# EAGLE design EXCISS PSU (EAGLE 7.7.0)

## Sheet 1 of 2
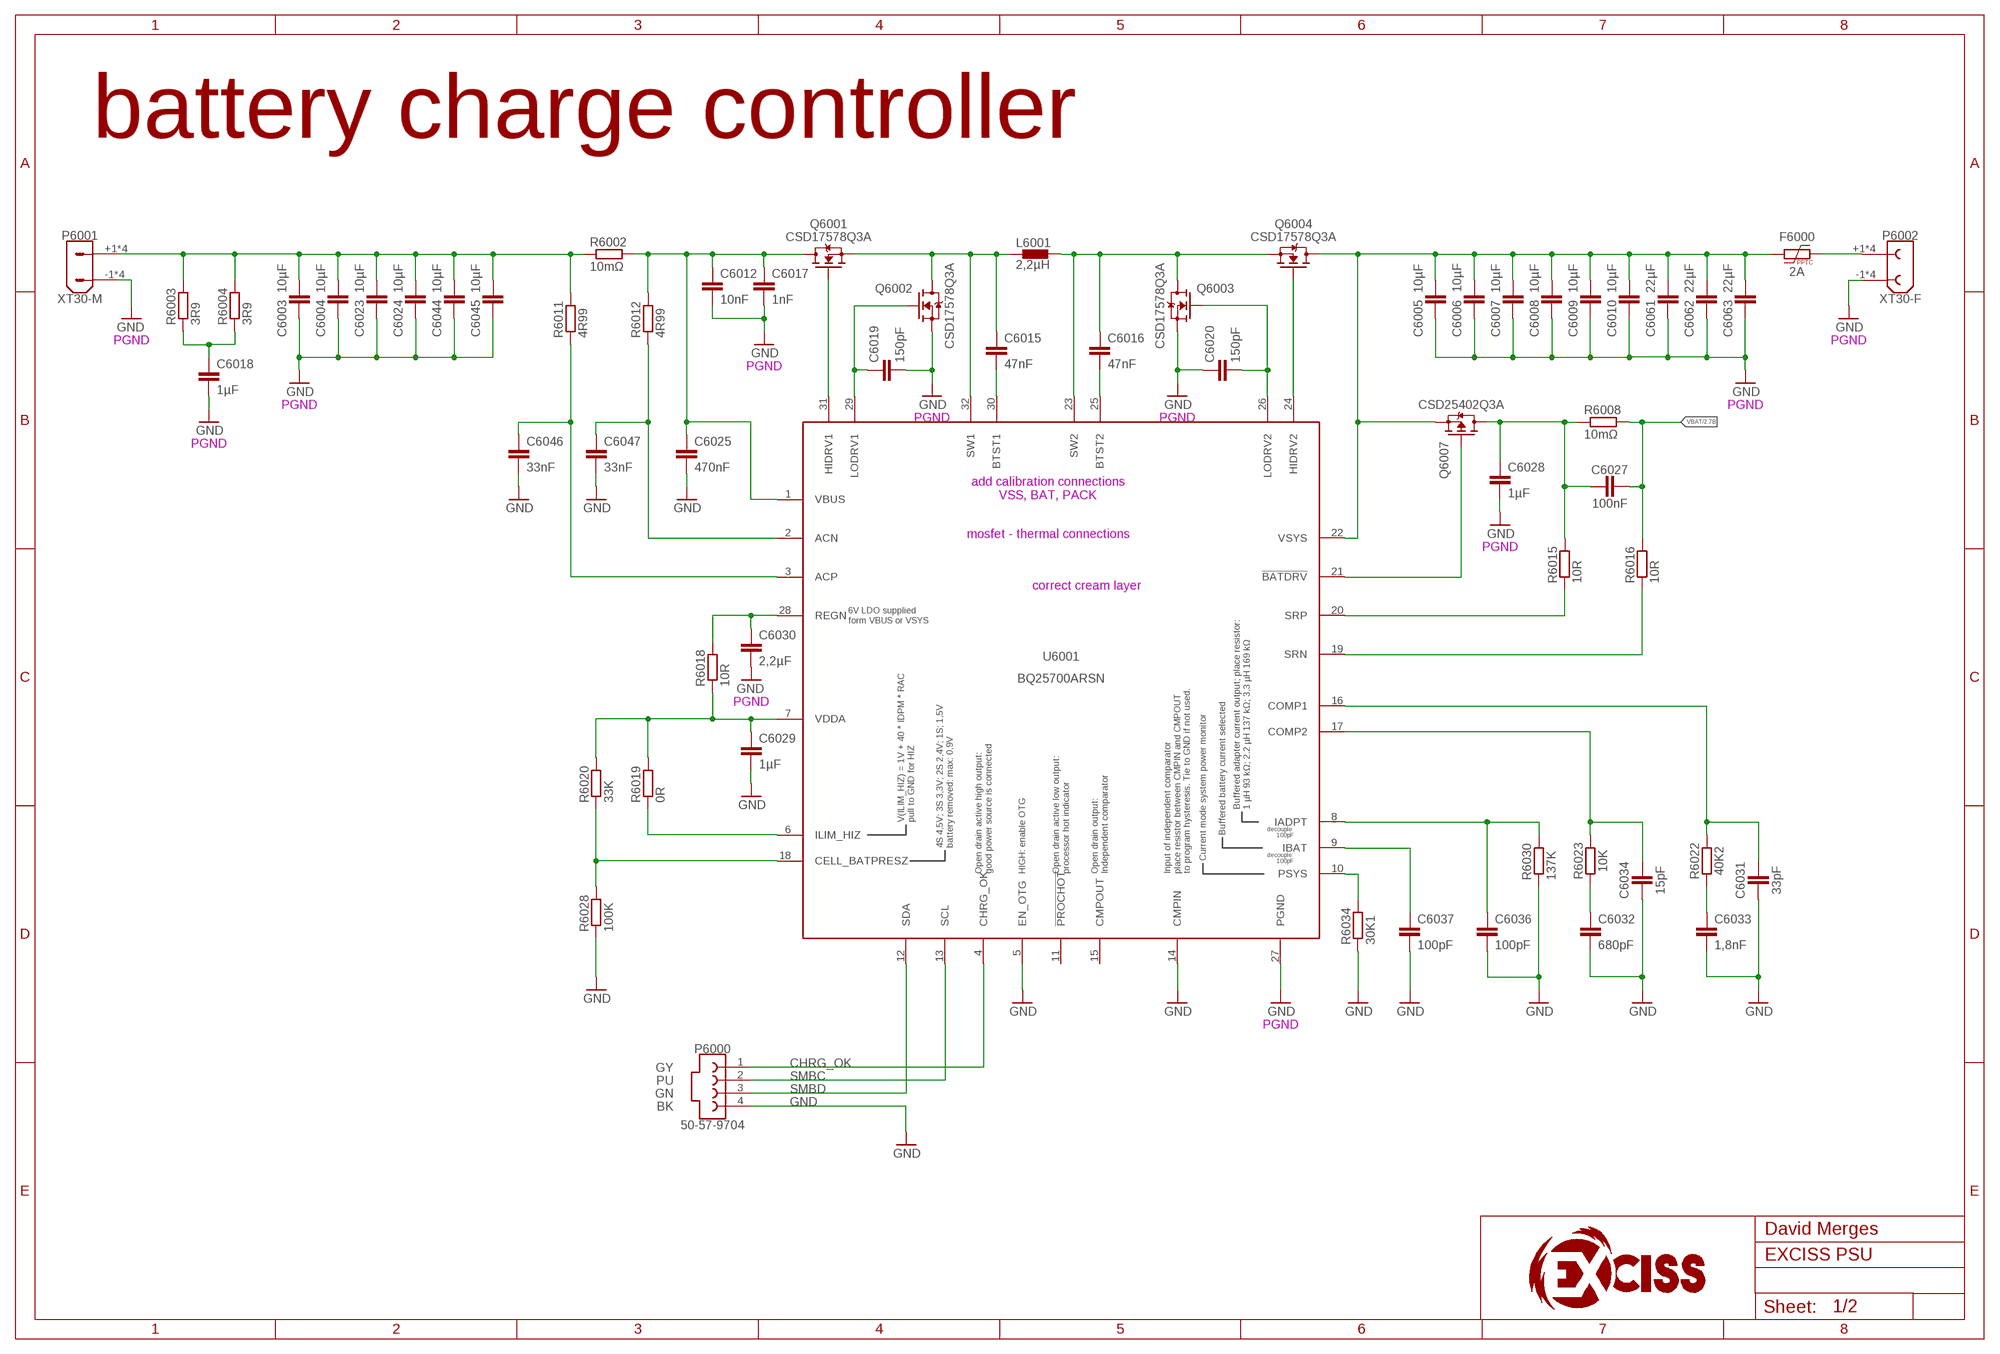
[diagram p0: schematic, sheet 1]

### Parts
C6003  10µF  C-EUC0805  [C0805]
C6004  10µF  C-EUC0805  [C0805]
C6005  10µF  C-EUC0805  [C0805]
C6006  10µF  C-EUC0805  [C0805]
C6007  10µF  C-EUC0805  [C0805]
C6008  10µF  C-EUC0805  [C0805]
C6009  10µF  C-EUC0805  [C0805]
C6010  10µF  C-EUC0805  [C0805]
C6012  10nF  C-EUC0603  [C0603]
C6015  47nF  C-EUC0603  [C0603]
C6016  47nF  C-EUC0603  [C0603]
C6017  1nF  C-EUC0603  [C0603]
C6018  1µF  C-EUC0603  [C0603]
C6019  150pF  C-EUC0603  [C0603]
C6020  150pF  C-EUC0603  [C0603]
C6023  10µF  C-EUC0805  [C0805]
C6024  10µF  C-EUC0805  [C0805]
C6025  470nF  C-EUC0805  [C0805]
C6027  100nF  C-EUC0603  [C0603]
C6028  1µF  C-EUC0603  [C0603]
C6029  1µF  C-EUC0603  [C0603]
C6030  2,2µF  C-EUC0603  [C0603]
C6031  33pF  C-EUC0603  [C0603]
C6032  680pF  C-EUC0603  [C0603]
C6033  1,8nF  C-EUC0603  [C0603]
C6034  15pF  C-EUC0603  [C0603]
C6036  100pF  C-EUC0603  [C0603]
C6037  100pF  C-EUC0603  [C0603]
C6044  10µF  C-EUC0805  [C0805]
C6045  10µF  C-EUC0805  [C0805]
C6046  33nF  C-EUC0603  [C0603]
C6047  33nF  C-EUC0603  [C0603]
C6061  22µF  C-EUC1210  [C1210]
C6062  22µF  C-EUC1210  [C1210]
C6063  22µF  C-EUC1210  [C1210]
F6000  2A  PTC_FUSE1812  [PTC_1812]
L6001  2,2µH  74437356022  [8030]
P6000  50-57-9704  14-56-2044EXCISS_PSU_DATA  [RENAME-SIGNAL]
P6001  XT30-M  XT30-M_WP  [RENAME_XT-CONNECTOR]
P6002  XT30-F  XT30-F_WP  [RENAME_XT-CONNECTOR]
Q6001  CSD17578Q3A  [Q3A]
Q6002  CSD17578Q3A  [Q3A]
Q6003  CSD17578Q3A  [Q3A]
Q6004  CSD17578Q3A  [Q3A]
Q6007  CSD25402Q3A  [Q3A]
R6002  10mΩ  R-EU_R1206  [R1206]
R6003  3R9  R-EU_R1206  [R1206]
R6004  3R9  R-EU_R1206  [R1206]
R6008  10mΩ  R-EU_R1206  [R1206]
R6011  4R99  R-EU_R0603  [R0603]
R6012  4R99  R-EU_R0603  [R0603]
R6015  10R  R-EU_R0603  [R0603]
R6016  10R  R-EU_R0603  [R0603]
R6018  10R  R-EU_R0603  [R0603]
R6019  0R  R-EU_R0603  [R0603]
R6020  33K  R-EU_R0603  [R0603]
R6022  40K2  R-EU_R0603  [R0603]
R6023  10K  R-EU_R0603  [R0603]
R6028  100K  R-EU_R0603  [R0603]
R6030  137K  R-EU_R0603  [R0603]
R6034  30K1  R-EU_R0603  [R0603]
U6001  BQ25700ARSN  [RSN(S-PWQFN-N32)]

### Nets
CHRG_OK: P6000.1 U6001.4(CHRG_OK)
GND: C6003.2 C6004.2 C6005.2 C6006.2 C6007.2 C6008.2 C6009.2 C6010.2 C6012.2 C6017.2 C6018.2 C6019.2 C6020.1 C6023.2 C6024.2 C6025.2 C6028.2 C6029.2 C6030.2 C6031.2 C6032.2 C6033.2 C6034.2 C6036.2 C6037.2 C6044.2 C6045.2 C6046.2 C6047.2 C6061.2 C6062.2 C6063.2 P6000.4 P6001.-1(-) P6001.-2(-) P6001.-3(-) P6001.-4(-) P6002.-1(-) P6002.-2(-) P6002.-3(-) P6002.-4(-) Q6002.1(S) Q6002.2(S) Q6002.3(S) Q6003.1(S) Q6003.2(S) Q6003.3(S) R6028.1 R6030.1 R6034.1 U6001.5(EN_OTG) U6001.14(CMPIN) U6001.27(PGND) ; also sheet 2
ISS_VBUS: C6003.1 C6004.1 C6023.1 C6024.1 C6044.1 C6045.1 P6001.+1(+) P6001.+2(+) P6001.+3(+) P6001.+4(+) R6002.1 R6003.2 R6004.2 R6011.2 ; also sheet 2
N$1: C6018.1 R6003.1 R6004.1
N$2: Q6007.4(G) U6001.21(!BATDRV)
N$3: C6032.1 R6023.1
N$4: R6015.1 U6001.20(SRP)
N$5: C6027.1 C6028.1 Q6007.1(D) Q6007.2(D) Q6007.3(D) R6008.1 R6015.2
N$7: R6016.1 U6001.19(SRN)
N$8: Q6001.4(G) U6001.31(HIDRV1)
N$9: C6019.1 Q6002.4(G) U6001.29(LODRV1)
N$10: C6015.2 U6001.30(BTST1)
N$11: C6016.1 L6001.P$2 Q6003.TP0(D) Q6003.TP1(D) Q6003.TP2(D) Q6003.TP3(D) Q6003.TP4(D) Q6003.TP5(D) Q6003.TP6(D) Q6003.TP7(D) Q6004.1(S) Q6004.2(S) Q6004.3(S) U6001.23(SW2)
N$12: C6034.1 R6023.2 U6001.17(COMP2)
N$14: C6036.1 R6030.2 U6001.8(IADPT)
N$15: R6019.1 U6001.6(ILIM_HIZ)
N$16: C6033.1 R6022.1
N$17: C6020.2 Q6003.4(G) U6001.26(LODRV2)
N$18: Q6004.4(G) U6001.24(HIDRV2)
N$19: C6031.1 R6022.2 U6001.16(COMP1)
N$20: C6015.1 L6001.P$1 Q6001.1(S) Q6001.2(S) Q6001.3(S) Q6002.TP0(D) Q6002.TP1(D) Q6002.TP2(D) Q6002.TP3(D) Q6002.TP4(D) Q6002.TP5(D) Q6002.TP6(D) Q6002.TP7(D) U6001.32(SW1)
N$21: R6034.2 U6001.10(PSYS)
N$22: C6037.1 U6001.9(IBAT)
N$25: C6046.1 R6011.1 U6001.3(ACP)
N$26: C6047.1 R6012.1 U6001.2(ACN)
N$27: C6016.2 U6001.25(BTST2)
N$28: C6012.1 C6017.1 C6025.1 Q6001.TP0(D) Q6001.TP1(D) Q6001.TP2(D) Q6001.TP3(D) Q6001.TP4(D) Q6001.TP5(D) Q6001.TP6(D) Q6001.TP7(D) R6002.2 R6012.2 U6001.1(VBUS)
N$56: R6020.1 R6028.2 U6001.18(CELL_BATPRESZ)
REGN: C6030.1 R6018.2 U6001.28(REGN)
SMBC: P6000.2 U6001.13(SCL) ; also sheet 2
SMBD: P6000.3 U6001.12(SDA) ; also sheet 2
VBAT: C6027.2 R6008.2 R6016.2 ; also sheet 2
VDDA: C6029.1 R6018.1 R6019.2 R6020.2 U6001.7(VDDA)
VSYS_UPS: F6000.P$3 P6002.+1(+) P6002.+2(+) P6002.+3(+) P6002.+4(+) ; also sheet 2
VSYS_UPS_PREFUSE: C6005.1 C6006.1 C6007.1 C6008.1 C6009.1 C6010.1 C6061.1 C6062.1 C6063.1 F6000.P$2 Q6004.TP0(D) Q6004.TP1(D) Q6004.TP2(D) Q6004.TP3(D) Q6004.TP4(D) Q6004.TP5(D) Q6004.TP6(D) Q6004.TP7(D) Q6007.TP0(S) Q6007.TP1(S) Q6007.TP2(S) Q6007.TP3(S) Q6007.TP4(S) Q6007.TP5(S) Q6007.TP6(S) Q6007.TP7(S) U6001.22(VSYS)
Unconnected: U6001.11(!PROCHOT) U6001.15(CMPOUT)

### Notes on the sheet
- battery charge controller
- PGND | PGND
- PGND
- PGND | PGND
- PGND | PGND
- PGND
- add calibration connections
  VSS, BAT, PACK
- mosfet - thermal connections
- PGND
- correct cream layer
- PGND
- PGND
- GY
- PU
- GN
- BK

## Sheet 2 of 2
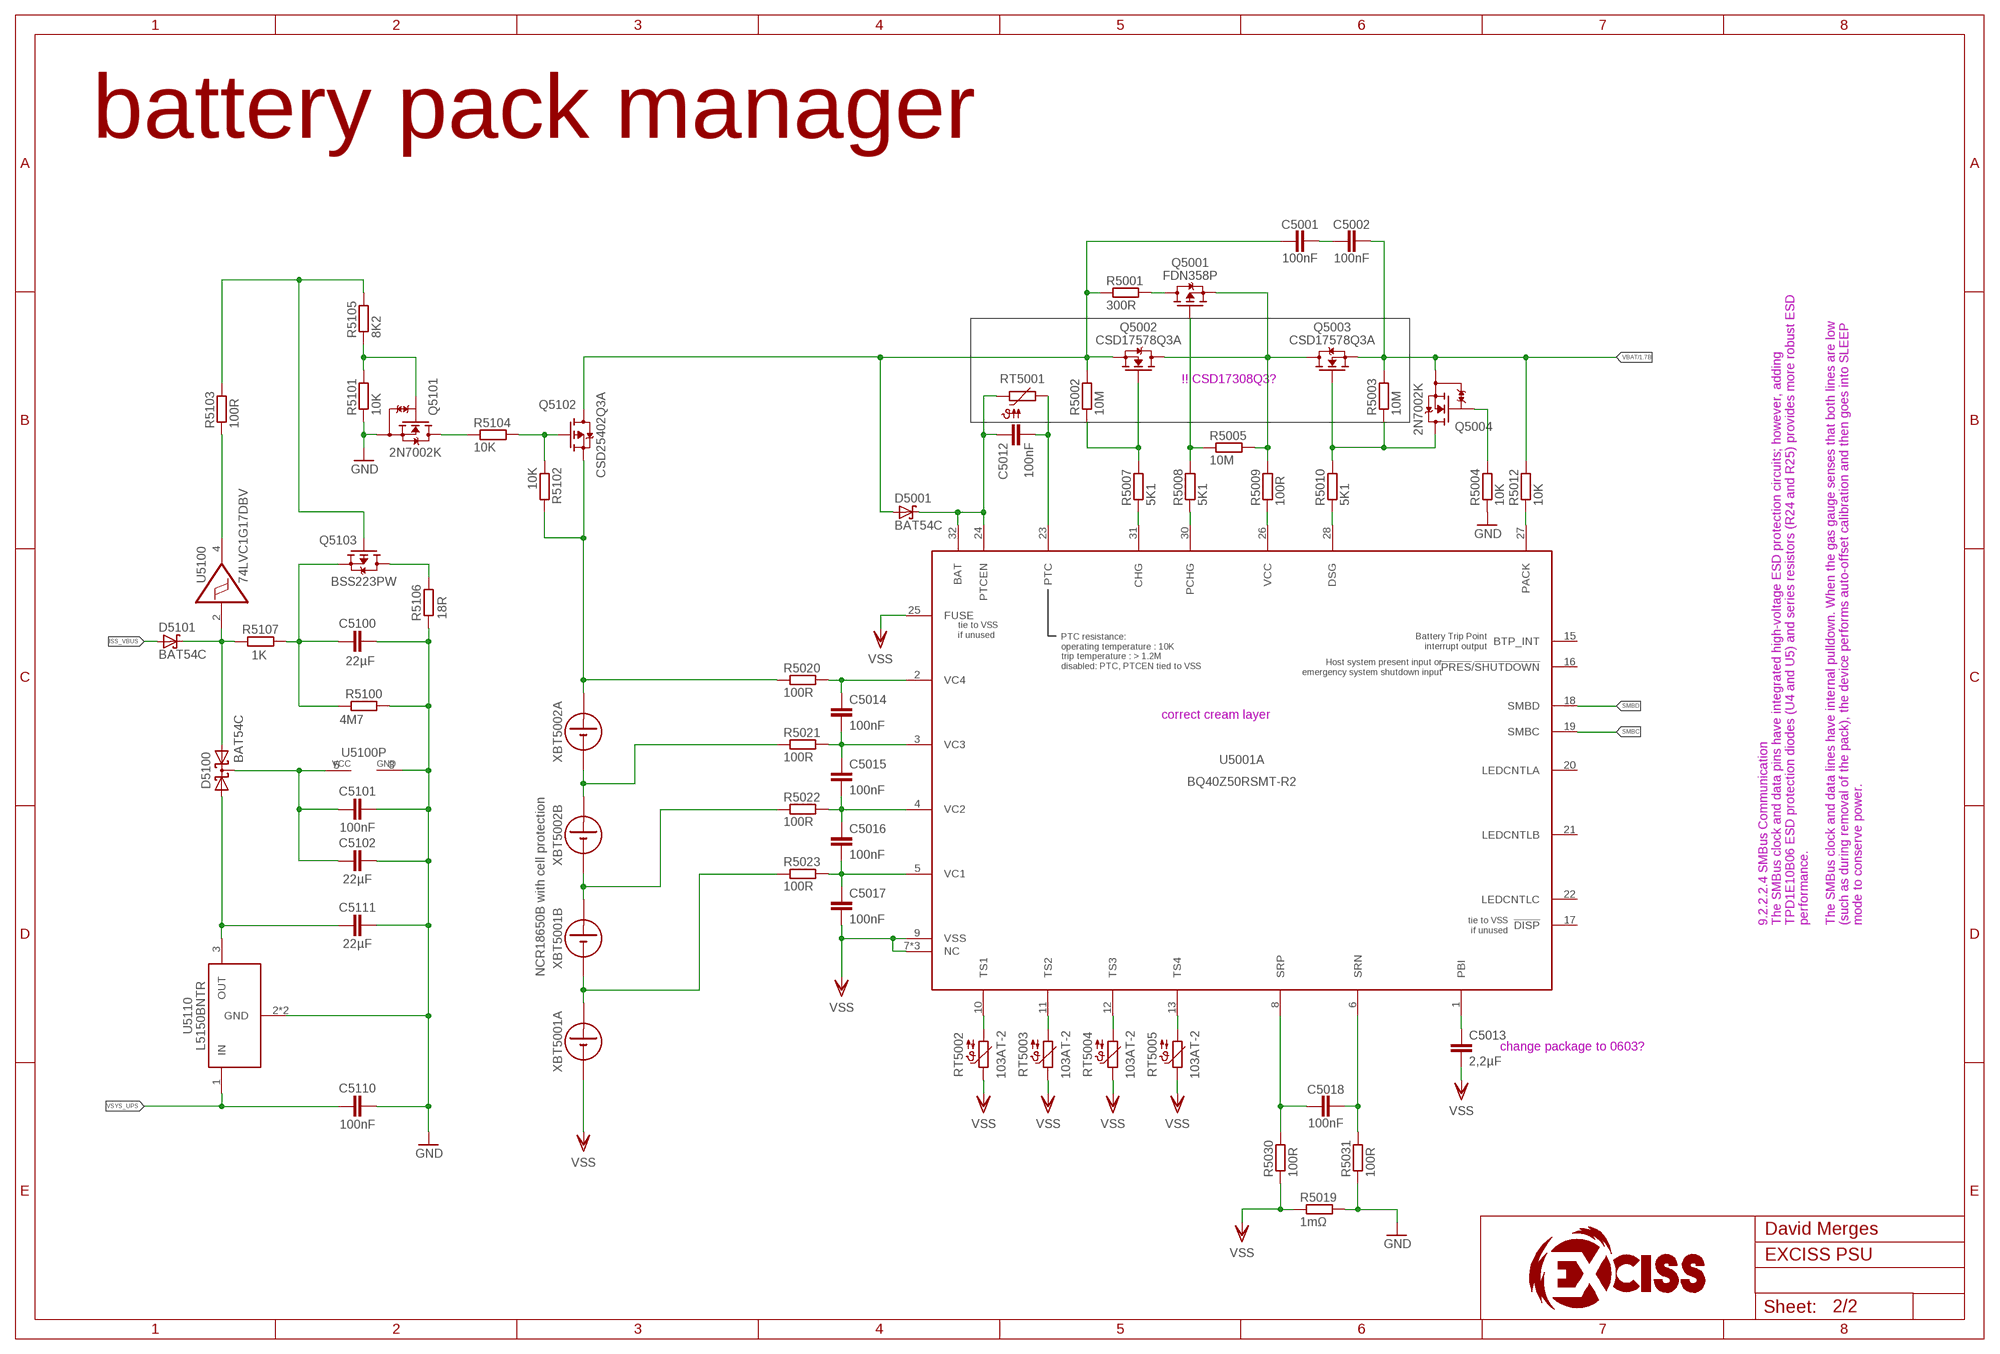
[diagram p1: schematic, sheet 2]

### Parts
C5001  100nF  C-EUC0603  [C0603]
C5002  100nF  C-EUC0603  [C0603]
C5012  100nF  C-EUC0603  [C0603]
C5013  2,2µF  C-EUC0805  [C0805]
C5014  100nF  C-EUC0603  [C0603]
C5015  100nF  C-EUC0603  [C0603]
C5016  100nF  C-EUC0603  [C0603]
C5017  100nF  C-EUC0603  [C0603]
C5018  100nF  C-EUC0603  [C0603]
C5100  22µF  C-EUC0805  [C0805]
C5101  100nF  C-EUC0603  [C0603]
C5102  22µF  C-EUC0805  [C0805]
C5110  100nF  C-EUC0603  [C0603]
C5111  22µF  C-EUC0805  [C0805]
D5001  BAT54C  BAT54  [SOT23]
D5100  BAT54C  [SOT23]
D5101  BAT54C  BAT54  [SOT23]
Q5001  FDN358P  [SOT23-3]
Q5002  CSD17578Q3A  [Q3A]
Q5003  CSD17578Q3A  [Q3A]
Q5004  2N7002K  [SOT23-3]
Q5101  2N7002K  [SOT23-3]
Q5102  CSD25402Q3A  [Q3A]
Q5103  BSS223PW  [DCK(R-PDSO-G3)]
R5001  300R  R-EU_R2512  [R2512]
R5002  10M  R-EU_R0603  [R0603]
R5003  10M  R-EU_R0603  [R0603]
R5004  10K  R-EU_R0603  [R0603]
R5005  10M  R-EU_R0603  [R0603]
R5007  5K1  R-EU_R0603  [R0603]
R5008  5K1  R-EU_R0603  [R0603]
R5009  100R  R-EU_R0603  [R0603]
R5010  5K1  R-EU_R0603  [R0603]
R5012  10K  R-EU_R0603  [R0603]
R5019  1mΩ  R-EU_R1206  [R1206]
R5020  100R  R-EU_R0603  [R0603]
R5021  100R  R-EU_R0603  [R0603]
R5022  100R  R-EU_R0603  [R0603]
R5023  100R  R-EU_R0603  [R0603]
R5030  100R  R-EU_R0603  [R0603]
R5031  100R  R-EU_R0603  [R0603]
R5100  4M7  R-EU_R0805  [R0805]
R5101  10K  R-EU_R0603  [R0603]
R5102  10K  R-EU_R0603  [R0603]
R5103  100R  R-EU_R0603  [R0603]
R5104  10K  R-EU_R0603  [R0603]
R5105  8K2  R-EU_R0603  [R0603]
R5106  18R  R-EU_R0805  [R0805]
R5107  1K  R-EU_R0603  [R0603]
RT5001  PRF15BB103RB6RC  [0402]
RT5002  103AT-2  [AT-2]
RT5003  103AT-2  [AT-2]
RT5004  103AT-2  [AT-2]
RT5005  103AT-2  [AT-2]
U5001  BQ40Z50RSMT-R2  BQ40Z50-R2RSM  [RSM(S-PVQFN-N32)]
U5100  74LVC1G17DBV  [SOT23-5]
U5110  L5150BNTR  NCV4274CST50T3G  [SOT223]
XBT5001  KEYSTONE_1049_LONG  [KEYSTONE_1049_LONG]
XBT5002  KEYSTONE_1049_LONG  [KEYSTONE_1049_LONG]

### Nets
1P: R5023.1 XBT5001.1+(A:+) XBT5001.2-(B:-)
2P: R5022.1 XBT5001.2+(B:+) XBT5002.2-(B:-)
3P: R5021.1 XBT5002.1-(A:-) XBT5002.2+(B:+)
4P: Q5102.TP0(S) Q5102.TP1(S) Q5102.TP2(S) Q5102.TP3(S) Q5102.TP4(S) Q5102.TP5(S) Q5102.TP6(S) Q5102.TP7(S) R5020.1 R5102.2 XBT5002.1+(A:+)
4P_SWITCHED: C5001.1 D5001.1(A) Q5002.1(S) Q5002.2(S) Q5002.3(S) Q5102.1(D) Q5102.2(D) Q5102.3(D) R5001.1 R5002.2
GND: C5100.2 C5101.2 C5102.2 C5110.2 C5111.2 Q5101.2(S) R5004.1 R5019.2 R5031.1 R5100.1 R5101.1 R5106.2 U5100.3(GND) U5110.2(GND) U5110.4(GND) ; also sheet 1
ISS_VBUS: D5101.1(A) ; also sheet 1
N$6: Q5102.4(G) R5102.1 R5104.2
N$13: R5103.1 U5100.4(O)
N$23: Q5101.1(G) R5101.2 R5105.1
N$24: Q5101.3(D) R5104.1
N$30: C5100.1 Q5103.2(S) R5100.2 R5107.1
N$32: R5010.1 U5001.28(A:DSG)
N$34: C5001.2 C5002.1
N$35: Q5001.2(S) Q5002.TP0(D) Q5002.TP1(D) Q5002.TP2(D) Q5002.TP3(D) Q5002.TP4(D) Q5002.TP5(D) Q5002.TP6(D) Q5002.TP7(D) Q5003.TP0(D) Q5003.TP1(D) Q5003.TP2(D) Q5003.TP3(D) Q5003.TP4(D) Q5003.TP5(D) Q5003.TP6(D) Q5003.TP7(D) R5005.2 R5009.2
N$36: Q5103.3(D) R5106.1
N$37: Q5002.4(G) R5002.1 R5007.2
N$38: R5007.1 U5001.31(A:CHG)
N$39: Q5001.3(D) R5001.2
N$40: Q5001.1(G) R5005.1 R5008.2
N$41: R5009.1 U5001.26(A:VCC)
N$42: C5101.1 C5102.1 D5100.3(CC) U5100.5(VCC)
N$43: Q5003.4(G) Q5004.3(D) R5003.1 R5010.2
N$44: R5008.1 U5001.30(A:PCHG)
N$45: Q5004.1(G) R5004.2
N$46: R5012.1 U5001.27(A:PACK)
N$47: C5014.1 R5020.2 U5001.2(A:VC4)
N$48: C5014.2 C5015.1 R5021.2 U5001.3(A:VC3)
N$49: C5015.2 C5016.1 R5022.2 U5001.4(A:VC2)
N$50: C5016.2 C5017.1 R5023.2 U5001.5(A:VC1)
N$51: C5013.1 U5001.1(A:PBI)
N$52: C5012.1 D5001.3(C) RT5001.1 U5001.24(A:PTCEN) U5001.32(A:BAT)
N$53: C5012.2 RT5001.2 U5001.23(A:PTC)
N$54: C5018.2 R5031.2 U5001.6(A:SRN)
N$55: C5018.1 R5030.2 U5001.8(A:SRP)
N$62: RT5002.P$2 U5001.10(A:TS1)
N$63: RT5003.P$2 U5001.11(A:TS2)
N$64: RT5004.P$2 U5001.12(A:TS3)
N$65: RT5005.P$2 U5001.13(A:TS4)
N$77: Q5103.1(G) R5103.2 R5105.2
N$78: D5100.1(A1) D5101.3(C) R5107.2 U5100.2(I)
OUT: C5111.1 D5100.2(A2) U5110.3(OUT)
SMBC: U5001.19(A:SMBC) ; also sheet 1
SMBD: U5001.18(A:SMBD) ; also sheet 1
VBAT: C5002.2 Q5003.1(S) Q5003.2(S) Q5003.3(S) Q5004.2(S) R5003.2 R5012.2 ; also sheet 1
VSS: C5013.2 C5017.2 R5019.1 R5030.1 RT5002.P$1 RT5003.P$1 RT5004.P$1 RT5005.P$1 U5001.7(A:NC) U5001.9(A:VSS) U5001.14(A:NC) U5001.25(A:FUSE) U5001.29(A:NC) XBT5001.1-(A:-)
VSYS_UPS: C5110.1 U5110.1(IN) ; also sheet 1
Unconnected: U5001.15(A:BTP_INT) U5001.16(A:!PRES!/!SHUTDOWN!) U5001.17(A:!DISP) U5001.20(A:LEDCNTLA) U5001.21(A:LEDCNTLB) U5001.22(A:LEDCNTLC)

### Notes on the sheet
- battery pack manager
- !! CSD17308Q3?
- correct cream layer
- NCR18650B with cell protection
- 9.2.2.2.4 SMBus Communication
  The SMBus clock and data pins have integrated high-voltage ESD protection circuits; however, adding
  TPD1E10B06 ESD protection diodes (U4 and U5) and series resistors (R24 and R25) provides more robust ESD
  performance.
  
  The SMBus clock and data lines have internal pulldown. When the gas gauge senses that both lines are low
  (such as during removal of the pack), the device performs auto-offset calibration and then goes into SLEEP
  mode to conserve power.
- change package to 0603?

## Power pins joined to a net without a drawn wire
GND: U6001.TP0(GND) U6001.TP1(GND) U6001.TP2(GND) U6001.TP3(GND) U6001.TP4(GND) U6001.TP5(GND) U6001.TP6(GND) U6001.TP7(GND) U6001.TP8(GND) U6001.TP9(GND)
VSS: U5001.TP0(T:VSS) U5001.TP1(T:VSS)

## Library data of the parts
C5001 C5002 C5012-C5018 C5100-C5102 C5110 C5111 C6003-C6010 C6012 C6015-C6020 C6023-C6025 C6027-C6034 C6036 C6037 C6044-C6047 C6061-C6063 = rcl:C-EU: CAPACITOR, European symbol
D5001 D5101 = diode:BAT54: Schottky Diodes Source: Fairchild .. BAT54.pdf
D5100 = diode:BAT54C: Schottky Diodes Source: Fairchild .. BAT54.pdf
F6000 = exciss:PTC_FUSE
L6001 = exciss:74437356022: 74437356022 WE-LHMI SMD Speicherdrossel Links Datasheet <http://katalog.we-online.de/pbs/datasheet/74437356022.pdf> Product website <http://katalog.we-online.de/de/pbs/WE-LHMI/74437356022>
P6000 = exciss:14-56-2044: 14-56-2044 2.54mm Pitch SL Insulation Displacement Connector Assembly, Female, Single Row, Version G, Positive Lock, Wire Size 26 AWG, 0.38µm Gold (Au), 4 Circuits Links Datasheet <http://www.molex.com/webdocs/datasheets/pdf/en-us//0014562044_RB_CBL_WR_TRP_CONN.pdf> Product website <http://www.molex.com/molex/products/datasheet.jsp?part=active/0014562044_RB_CBL_WR_TRP_CONN.xml>
P6001 = exciss:XT30-M
P6002 = exciss:XT30-F
Q5001 = exciss:FDN358P: FDN358P Single P-Channel, Logic Level, PowerTrench MOSFET Links Datasheet <http://www.onsemi.com/pub/Collateral/FDN358P-D.PDF> Product website <http://www.onsemi.com/PowerSolutions/product.do?id=FDN358P>
Q5002 Q5003 Q6001-Q6004 = exciss:CSD17578Q3A: CSD17578Q3A CSD17578Q3A 30 V N-Channel NexFET™ Power MOSFET Links Datasheet <http://www.ti.com/lit/gpn/csd17578q3a> Product website <http://www.ti.com/product/CSD17578Q3A>
Q5004 Q5101 = exciss:2N7002K: 2N7002K N-Channel 60 V (D-S) MOSFET Links Datasheet <https://www.vishay.com/docs/71333/2n7002k.pdf> Product website <https://www.vishay.com/mosfets/list/product-71333/>
Q5102 Q6007 = exciss:CSD25402Q3A: CSD25402Q3A P-Channel NexFET Power MOSFET Links Datasheet <http://www.ti.com/lit/gpn/csd25402q3a> Product website <http://www.ti.com/product/CSD25402Q3A>
Q5103 = exciss:BSS223PW: BSS 223PW OptiMOS©-P Small-Signal-Transistor Links Datasheet <https://www.infineon.com/dgdl/Infineon-BSS223PW-DS-v01_05-en.pdf?fileId=db3a3043321e49940132481523b6245f>; OC_MOUSER: 726-BSS223PWH6327
R5001-R5005 R5007-R5010 R5012 R5019-R5023 R5030 R5031 R5100-R5107 R6002-R6004 R6008 R6011 R6012 R6015 R6016 R6018-R6020 R6022 R6023 R6028 R6030 R6034 = rcl:R-EU_: RESISTOR, European symbol
RT5001 = exciss:PRF15BB103RB6RC: PRF15BB103RB6RC PTC Thermistors (POSISTOR®) Links Datasheet <https://www.murata.com/en-eu/api/pdfdownloadapi?cate=&partno=PRF15BB103RB6RC> Product website <https://www.murata.com/en-eu/products/productdetail?partno=PRF15BB103RB6RC>
RT5002-RT5005 = exciss:103AT-2: AT-2 AT Thermistor Series (high accuracy type) Links Datasheet <http://www.atcsemitec.co.uk/pdfdocs/AT-2-thermistors.pdf> Product website <http://www.atcsemitec.co.uk/at-thermistors.html>
U5001 = exciss:BQ40Z50-R2: BQ40Z50-R2 1-Series, 2-Series, 3-Series, and 4-Series Li-Ion Battery Links Datasheet <http://www.ti.com/lit/gpn/bq40z50-r2> Product website <http://www.ti.com/product/BQ40Z50-R2>; OC_MOUSER: 595-BQ40Z50RSMT-R2
U5100 = 74xx-little-de:74*1G17: Single Schmitt-Trigger Buffer
U5110 = exciss:NCV4274C: NCV4274C 400 mA Low Dropout Voltage Regulator Links Datasheet <http://www.onsemi.com/pub/Collateral/NCV4274C-D.PDF> Product website <http://www.onsemi.com/PowerSolutions/product.do?id=NCV4274C>; OC_MOUSER: 863-NCV4274CST50T3G
U6001 = exciss:BQ25700A: BQ25700A NVDC SMBus Battery Buck-Boost Charge Controller with System Power Monitor & Processor Links Datasheet <http://www.ti.com/lit/gpn/bq25700a> Product website <http://www.ti.com/product/BQ25700A>
XBT5001 XBT5002 = exciss:KEYSTONE_1049: Keystone 1049 THM Holder for Dual 18650 Batteries P/N 1049 Links Datasheet <http://www.keyelco.com/product-pdf.cfm?p=921> Product website <http://www.keyelco.com/product.cfm/product_id/921>

## Board
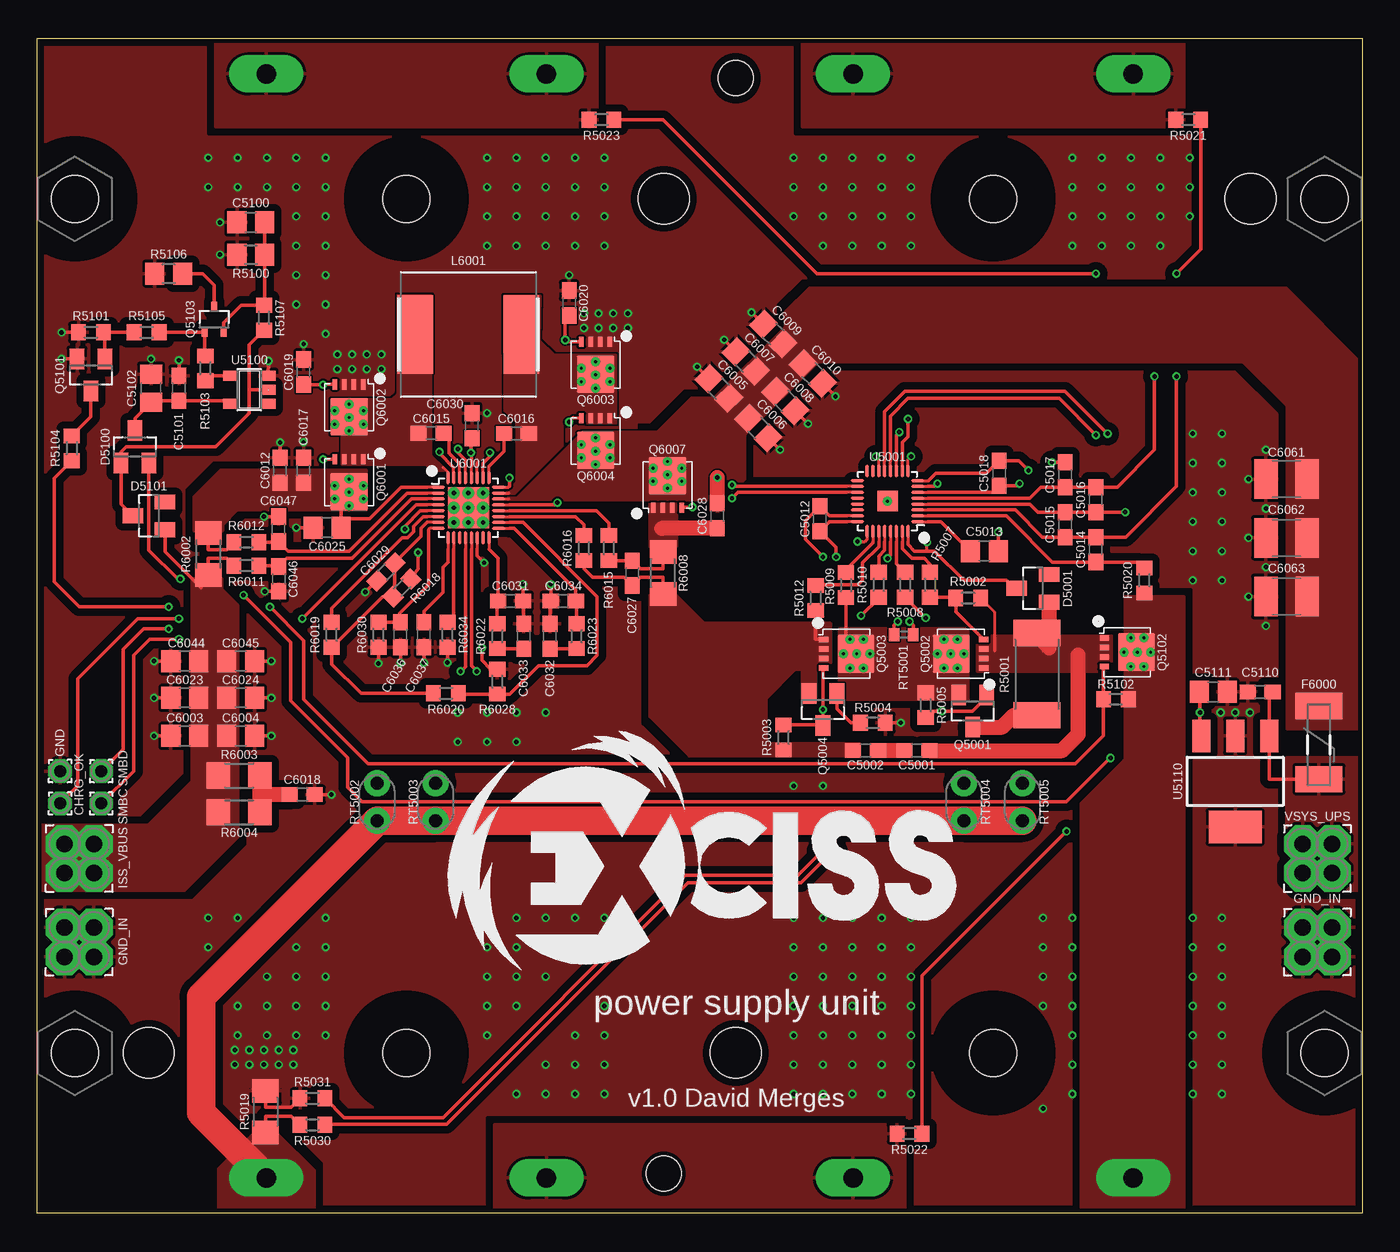
[diagram p2: board, top side]
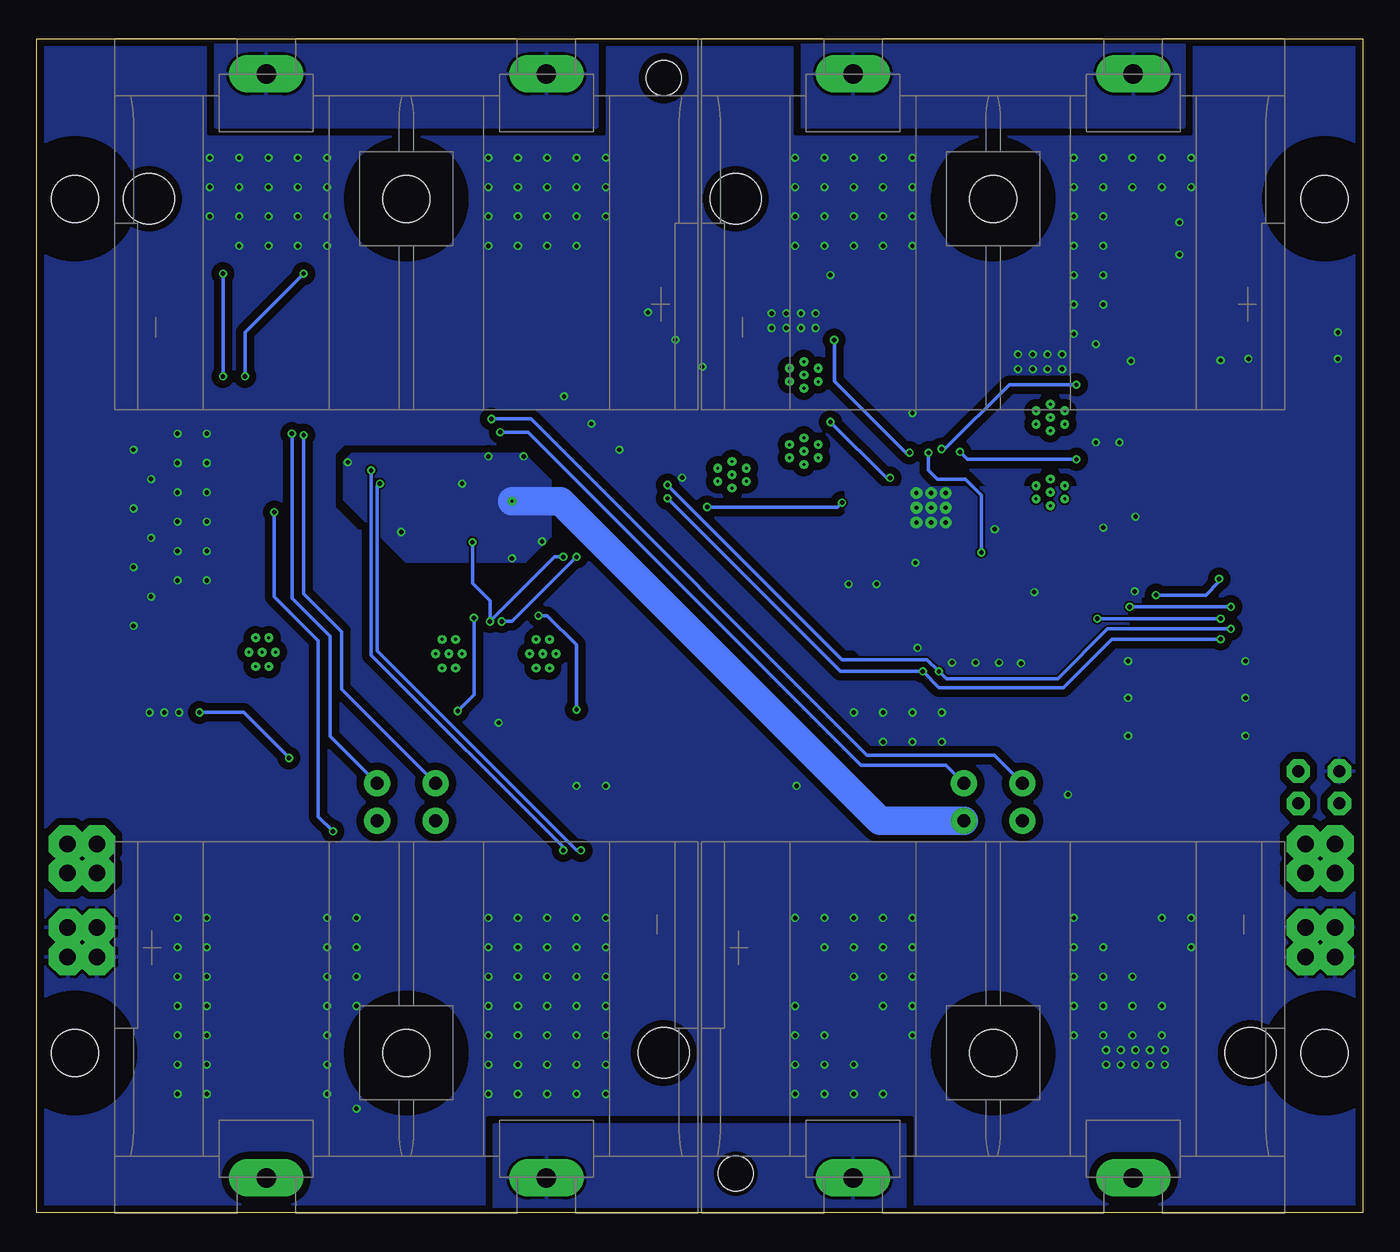
[diagram p3: board, bottom side, seen from below]

Size 90.4 x 80 mm. Coordinates in mm from the lower left corner, seen from the top.
Outline: 90.4,0 90.4,80 0,80 0,0 90.4,0
Copper layers (1*16): Top 0.035mm / dielectric 1.5mm / Bottom 0.035mm
Design rules "PCB-POOL HighSpec *": minimum track width 0.125mm, minimum drill 0.2mm, track to track 0.125mm, track to pad 0.125mm, pad to pad 0.125mm, via to via 0.125mm, smd to smd 0.125mm, copper to edge 0.3mm, drill to drill 0.2mm, minimum pad ring 0.2mm, minimum via ring 0.125mm, stop-mask expansion 0.075mm, vias tented up to drill 0.3mm, thermal gap 0.2mm

### Footprints (pad centres in the part's own frame; a part is rotated, then mirrored left to right if it is on the bottom)
C0603 = smd 1.1 x 1: 1 -0.85,0; 2 0.85,0
C0805 = smd 1.3 x 1.5: 1 -0.95,0; 2 0.95,0
C1210 = smd 1.6 x 2.7: 1 -1.4,0; 2 1.4,0
SOT23 = smd 1 x 1.4: 1 -0.95,-1.1; 2 0.95,-1.1; 3 0,1.1
PTC_1812 = smd 1.78 x 3.2: P$2 -2.64,0; P$3 2.34,0
8030 = smd 2.42 x 5.33: P$1 -3.62,0; P$2 3.62,0
RENAME-SIGNAL = drill 0.813 pad 1.6 octagon: 1 -1.4,-1.1; 2 1.4,-1.1; 3 1.4,1.1; 4 -1.4,1.1
RENAME_XT-CONNECTOR = drill 1.118 pad 2.54 octagon: +1 -1,3.85; +2 1,3.85; +3 -1,1.85; +4 1,1.85; -1 -1,-1.85; -2 1,-1.85; -3 -1,-3.85; -4 1,-3.85
SOT23-3 = smd 1 x 1.4: 1 -0.95,-1.1; 2 0.95,-1.1; 3 0,1.1
Q3A = smd 0.7 x 0.4: 1 -1.55,0.975; 2 -1.55,0.325; 3 -1.55,-0.325; 4 -1.55,-0.975 | smd 2.51 x 2.55: TP0 0.647,0 | drill 0.2: TP1 0.245,0.975; TP2 1.15,0.975; TP3 -0.207,0; TP4 0.698,0; TP5 1.603,0; TP6 0.245,-0.975; TP7 1.15,-0.975
DCK(R-PDSO-G3) = smd 0.7 x 0.4: 1 -0.85,0.65; 2 -0.85,-0.65; 3 0.85,0
R2512 = smd 1.8 x 3.2: 1 -2.8,0; 2 2.8,0
R0603 = smd 1 x 1.1: 1 -0.85,0; 2 0.85,0
R1206 = smd 1.6 x 1.803: 1 -1.422,0; 2 1.422,0
R0805 = smd 1.3 x 1.5: 1 -0.95,0; 2 0.95,0
0402 = smd 0.7 x 0.9: 1 -0.65,0; 2 0.65,0
AT-2 = drill 0.9 pad 1.778: P$1 -1.27,0; P$2 1.27,0
RSM(S-PVQFN-N32) = smd 0.9 x 0.2: 1 -2.05,1.4; 2 -2.05,1; 3 -2.05,0.6; 4 -2.05,0.2; 5 -2.05,-0.2; 6 -2.05,-0.6; 7 -2.05,-1; 8 -2.05,-1.4; 17 2.05,-1.4; 18 2.05,-1; 19 2.05,-0.6; 20 2.05,-0.2; 21 2.05,0.2; 22 2.05,0.6; 23 2.05,1; 24 2.05,1.4 | smd 0.2 x 0.9: 9 -1.4,-2.05; 10 -1,-2.05; 11 -0.6,-2.05; 12 -0.2,-2.05; 13 0.2,-2.05; 14 0.6,-2.05; 15 1,-2.05; 16 1.4,-2.05; 25 1.4,2.05; 26 1,2.05; 27 0.6,2.05; 28 0.2,2.05; 29 -0.2,2.05; 30 -0.6,2.05; 31 -1,2.05; 32 -1.4,2.05 | smd 1.4 x 1.4: TP0 0,0 | drill 0.2: TP1 0,0
SOT23-5 = smd 0.69 x 0.99: 1 -0.95,-1.29; 2 0,-1.29; 3 0.95,-1.29; 4 0.95,1.3; 5 -0.95,1.3
SOT223 = smd 1.219 x 2.235: 1 -2.311,-3.099; 2 0,-3.099; 3 2.311,-3.099 | smd 3.6 x 2.2: 4 0,3.099
RSN(S-PWQFN-N32) = smd 0.9 x 0.2: 1 -2.05,1.4; 2 -2.05,1; 3 -2.05,0.6; 4 -2.05,0.2; 5 -2.05,-0.2; 6 -2.05,-0.6; 7 -2.05,-1; 8 -2.05,-1.4; 17 2.05,-1.4; 18 2.05,-1; 19 2.05,-0.6; 20 2.05,-0.2; 21 2.05,0.2; 22 2.05,0.6; 23 2.05,1; 24 2.05,1.4 | smd 0.2 x 0.9: 9 -1.4,-2.05; 10 -1,-2.05; 11 -0.6,-2.05; 12 -0.2,-2.05; 13 0.2,-2.05; 14 0.6,-2.05; 15 1,-2.05; 16 1.4,-2.05; 25 1.4,2.05; 26 1,2.05; 27 0.6,2.05; 28 0.2,2.05; 29 -0.2,2.05; 30 -0.6,2.05; 31 -1,2.05; 32 -1.4,2.05 | smd 2.8 x 2.8: TP0 0,0 | drill 0.3 pad 0.8: TP1 -1,1; TP2 -1,0; TP3 -1,-1; TP4 0,1; TP5 0,0; TP6 0,-1; TP7 1,1; TP8 1,0; TP9 1,-1
DRILL_M3_SPACER = hole 3.2: 0,0
KEYSTONE_1049_LONG = drill 1.32 pad 2.54 long: 1+ -37.61,9.55; 1- 37.61,9.55; 2+ 37.61,-9.55; 2- -37.61,-9.55 | hole 3.45: 29.1,17.55; -29.1,-17.55 | hole 2.39: 37.32,-17.55 | hole 3.2: -29.1,0; 29.1,0

### Placement (x,y rotation side)
C5001  60,31.5 180 top
C5002  56.5,31.5 180 top
C5012  53.4,47.3 90 top
C5013  64.6,45.1 0 top
C5014  72.2,45.2 90 top
C5015  70.1,46.9 90 top
C5016  72.2,48.6 90 top
C5017  70.1,50.3 90 top
C5018  65.6,50.4 270 top
C5100  14.6,67.5 180 top
C5101  9.7,56.2 90 top
C5102  7.8,56.2 90 top
C5110  83.4,35.5 180 top
C5111  80.2,35.5 0 top
C6003  10.1,32.5 180 top
C6004  13.9,32.5 0 top
C6005  46.5,56.18 135 top
C6006  49.19,53.49 315 top
C6007  48.34,58.02 135 top
C6008  51.03,55.33 315 top
C6009  50.21,59.88 135 top
C6010  52.9,57.2 315 top
C6012  16.6,50.6 90 top
C6015  26.89,53.13 0 top
C6016  32.7,53.1 180 top
C6017  18.2,50.6 90 top
C6018  18.1,28.5 0 top
C6019  18.2,57.3 90 top
C6020  36.3,62 270 top
C6023  10.1,35.1 180 top
C6024  13.9,35.1 0 top
C6025  19.8,46.7 180 top
C6027  40.6,43.6 270 top
C6028  46.4,47.5 90 top
C6029  23.8,43.67 225 top
C6030  29.68,53.64 90 top
C6031  32.3,41.7 0 top
C6032  35,39.3 90 top
C6033  33.2,39.3 90 top
C6034  35.9,41.7 180 top
C6036  24.8,39.4 270 top
C6037  26.4,39.4 270 top
C6044  10.1,37.6 180 top
C6045  13.9,37.6 0 top
C6046  16.5,43.2 270 top
C6047  16.5,46.6 90 top
C6061  85.2,50 180 top
C6062  85.2,46 180 top
C6063  85.2,42 180 top
D5001  67.91,42.56 90 top
D5100  6.7,52.2 0 top
D5101  7.65,47.5 90 top
F6000  87.4,31.9 270 top
L6001  29.43,59.86 0 top
P6000  3,29 0 top
P6001  2.9,21.3 0 top
P6002  87.3,21.3 0 top
Q5001  63.8,34.2 180 top
Q5002  63,38.1 180 top
Q5003  55.2,38.1 0 top
Q5004  53.6,34.3 180 top
Q5101  3.7,57.1 180 top
Q5102  74.33,38.21 0 top
Q5103  12.1,60.9 90 top
Q6001  21.3,49.8 270 top
Q6002  21.3,54.9 270 top
Q6003  38.1,57.8 270 top
Q6004  38.1,52.6 270 top
Q6007  43,49.6 90 top
R5001  68.18,36.71 270 top
R5002  63.5,41.9 0 top
R5003  50.9,32.4 270 top
R5004  57,33.4 180 top
R5005  60.6,34.6 90 top
R5007  60.9,42.8 270 top
R5008  59.2,42.8 270 top
R5009  55.17,42.78 270 top
R5010  57.4,42.8 270 top
R5012  53.1,41.9 270 top
R5019  15.6,6.9 90 top
R5020  75.5,43.1 90 top
R5021  78.5,74.5 0 top
R5022  59.5,5.4 0 top
R5023  38.5,74.5 0 top
R5030  18.8,6 0 top
R5031  18.8,7.8 0 top
R5100  14.6,65.3 0 top
R5101  3.7,60 0 top
R5102  73.57,35 0 top
R5103  11.5,57.55 90 top
R5104  2.4,52.1 270 top
R5105  7.5,60 0 top
R5106  9,64 180 top
R5107  15.5,61 270 top
R6002  11.7,44.9 90 top
R6003  13.8,29.8 180 top
R6004  13.8,27.3 180 top
R6008  42.7,43.6 270 top
R6011  14.3,44.1 180 top
R6012  14.3,45.7 180 top
R6015  39,45.3 270 top
R6016  37.3,45.3 270 top
R6018  24.9,42.59 45 top
R6019  20.1,39.4 270 top
R6020  27.9,35.4 180 top
R6022  31.4,39.3 90 top
R6023  36.8,39.3 90 top
R6028  31.4,36.2 270 top
R6030  23.3,39.4 90 top
R6034  28,39.4 90 top
RT5001  59.1,39.4 180 top
RT5002  23.2,28 90 top
RT5003  27.2,28 90 top
RT5004  63.2,28 90 top
RT5005  67.2,28 90 top
U5001  58,48.5 180 top
U5100  14.5,56.1 90 top
U5110  81.7,29.4 180 top
U6001  29.43,48.05 0 top
U$1  [DRILL_M3_SPACER]  2.6,69.1 0 top
U$2  [DRILL_M3_SPACER]  87.8,69.1 0 top
U$3  [DRILL_M3_SPACER]  87.8,10.9 0 top
U$4  [DRILL_M3_SPACER]  2.6,10.9 0 top
U$5  [LOGO_EXCISS]  47.7,23.56 0 top
XBT5001  25.2,40 270 bottom
XBT5002  65.2,40 90 bottom

### Tracks (layer width: path | path; a pad name or v marks a point on that pad's centre or on a via)
1P
  pour Top: 12.2,80 38.2,80 38.2,74 12.2,74
  pour Bottom: 38.2,80 12.2,80 12.2,74 38.2,74
2P
  pour Top: 31.2,6 59.2,6 59.2,0 31.2,0
  pour Bottom: 59.2,6 31.2,6 31.2,0 59.2,0
3P
  pour Top: 52.2,80 78.2,80 78.2,74 52.2,74
  pour Bottom: 78.2,80 52.2,80 52.2,74 78.2,74
4P
  pour Top (no thermals): 74.2,42 74.2,30.9 71.2,27.9 71.2,0 78.2,0 78.2,42
4P_SWITCHED
  Top 0.2: R5002.2 65.3,40.95 65.3,38.3
  Top 1.016: D5001.1 69.01,38.51 R5001.1 | C5001.1 69.9,31.5 71,32.6 71,38
  pour Top (rank 2, no thermals): 73.3,39.3 64.1,39.3 64.1,36.9 73.3,36.9
CHRG_OK  (via drill 0.3)
  Top 0.2: U6001.4 26.6,48.25
  Top 0.254: v9.7,40.5 6.9,40.5 2.8,36.4 2.8,29.1 P6000.1 | v18.1,40.5 25.85,48.25 26.6,48.25
  Bottom 0.254: v18.1,40.5 v9.7,40.5
GND  (via drill 0.3)
  Top 0.2: U6001.5 26.6,47.85 | U6001.27 30.03,51.12 | U6001.14 30.03,45.27
  Top 0.254: R5004.1 v58.9,33.4 | R5019.2 15.6,7.2 17.35,7.2 R5031.1 | Q5101.2 v1.7,58.2 | R5101.1 v1.7,60 | C5101.2 v9.7,58.1 | U5100.3 v15.8,58.05 | C6012.2 v16.6,52.5 | C6005.2 45.82,56.86 v45.02,57.66 | C6007.2 v46.86,59.5 | C6009.2 v48.73,61.37 | C6003.2 v8,32.5 | C6023.2 v8,35.1 | C6044.2 v8,37.6 | C6045.2 v16,37.6 | C6024.2 v16,35.1 | C6004.2 v16,32.5 | C6018.2 v20.1,28.5 | v54.45,55.64 C6010.2 | v52.59,53.77 51.6,54.76 C6008.2 | v50.68,52.01 C6006.2 | v35.05,42.85 C6034.2 35,41.7 C6032.2 | C6047.2 v15.5,47.45 | C6025.2 v17.7,46.7 | C6029.2 23.1,43 v22.4,42.3 | C6036.2 v24.8,37.5 | C6037.2 v26.4,37.5 | C6046.2 v15.55,42.35 | C6033.2 33.2,41.7 C6031.2 v33.15,42.85 | v28,37.5 R6034.1 | v23.3,37.45 R6030.1 | R6028.1 30.95,37.05 30.35,37.65 v30.35,38.5 | v25.1,46.6 25.1,46.8 26.15,47.85 26.6,47.85 | 30.03,45.27 30.03,44.77 v30.5,44.3
  Top 1.016: C6028.2 v46.4,50.1
  other vias: 20.5,58.5 37.3,61.3 38.3,61.3 39.3,61.3 40.3,61.3 40.3,60.3 39.3,60.3 38.3,60.3 37.3,60.3 21.5,58.5 22.5,58.5 23.5,58.5 23.5,57.5 22.5,57.5 21.5,57.5 20.5,57.5 19.7,59.9 12.5,67.5 18.2,52.5 18.2,59.2 36.3,63.9 15.5,11.1 14.5,11.1 13.5,11.1 16.5,11.1 17.5,11.1 17.5,10.1 16.5,10.1 15.5,10.1 14.5,10.1 13.5,10.1 12.5,65.3 30.7,54.5 82.6,46 83.8,44 82.6,42 83.8,48 83.8,40 82.7,34.1 81.7,34.1 80.7,34.1 83.8,52 82.6,50 7.8,58.2 19.7,61.9 19.7,63.9 19.7,65.9 19.7,67.9 19.7,69.9 19.7,71.9 13.7,69.9 13.7,71.9 11.7,69.9 11.7,71.9 17.7,61.9 17.7,63.9 17.7,65.9 17.7,67.9 17.7,69.9 17.7,71.9 15.7,69.9 15.7,71.9 38.7,69.9 38.7,71.9 32.7,69.9 32.7,71.9 30.7,69.9 30.7,71.9 36.7,69.9 36.7,71.9 34.7,69.9 34.7,71.9 38.7,65.9 38.7,67.9 32.7,65.9 32.7,67.9 30.7,65.9 30.7,67.9 36.7,65.9 36.7,67.9 34.7,65.9 34.7,67.9 59.6,69.9 59.6,71.9 53.6,69.9 53.6,71.9 51.6,69.9 51.6,71.9 57.6,69.9 57.6,71.9 55.6,69.9 55.6,71.9 59.6,65.9 59.6,67.9 53.6,65.9 53.6,67.9 51.6,67.9 57.6,65.9 57.6,67.9 55.6,65.9 55.6,67.9 78.6,69.9 78.6,71.9 72.6,69.9 72.6,71.9 70.6,69.9 70.6,71.9 76.6,69.9 76.6,71.9 74.6,69.9 74.6,71.9 78.6,67.9 72.6,65.9 72.6,67.9 70.6,65.9 70.6,67.9 76.6,65.9 76.6,67.9 74.6,65.9 74.6,67.9 51.6,10.1 51.6,8.1 57.6,10.1 57.6,8.1 59.6,10.1 59.6,8.1 53.6,10.1 53.6,8.1 55.6,10.1 55.6,8.1 51.6,14.1 51.6,12.1 57.6,14.1 57.6,12.1 59.6,12.1 53.6,14.1 53.6,12.1 55.6,14.1 55.6,12.1 59.6,14.1 51.6,16.1 57.6,16.1 59.6,16.1 53.6,16.1 55.6,16.1 51.6,20.1 51.6,18.1 57.6,20.1 57.6,18.1 59.6,18.1 53.6,20.1 53.6,18.1 55.6,20.1 55.6,18.1 59.6,20.1 70.6,10.1 70.6,8.1 78.8,10.1 78.8,8.1 70.6,14.1 70.6,12.1 78.8,12.1 78.8,14.1 70.6,16.1 78.8,16.1 70.6,20.1 70.6,18.1 78.8,18.1 78.8,20.1 68.6,14.1 68.6,16.1 68.6,20.1 68.6,18.1 80.8,10.1 80.8,8.1 80.8,12.1 80.8,14.1 80.8,16.1 80.8,18.1 80.8,20.1 68.6,7.1 17.7,14.1 13.7,14.1 15.7,14.1 19.7,14.1 17.7,16.1 19.7,16.1 15.7,16.1 11.7,20.1 11.7,18.1 17.7,18.1 19.7,18.1 13.7,20.1 19.7,20.1 36.7,10.1 36.7,8.1 38.7,10.1 38.7,8.1 32.7,8.1 34.7,10.1 34.7,8.1 30.7,14.1 30.7,12.1 36.7,12.1 38.7,12.1 32.7,14.1 38.7,14.1 30.7,16.1 32.7,16.1 34.7,16.1 30.7,20.1 30.7,18.1 36.7,20.1 36.7,18.1 32.7,20.1 32.7,18.1 34.7,20.1 34.7,18.1 38.7,20.1 17.7,12.1 13.7,12.1 15.7,12.1 19.7,12.1 30.7,32.1 30.7,34.1 32.7,34.1 32.7,32.1 34.7,34.1 28.7,32.1 28.7,34.1 51.6,29.1 53.6,29.1 38.6,29.1 78.8,43.1 78.8,45.1 78.8,47.1 78.8,49.1 78.8,51.1 78.8,53.1 80.8,53.1 80.8,51.1 80.8,49.1 80.8,47.1 80.8,45.1 80.8,43.1
  pour Bottom (isolate 0.5, rank 6): 90.4,80 0,80 0,0 90.4,0
  pour Top (rank 5): 17,64 40.86,64 40.86,51 17,51
  pour Top (no thermals): 17.8,11.3 17.8,9.8 16.5,8.5 14.7,8.5 13.3,9.9 13.3,11.3
  pour Top (isolate 0.5, rank 6): 90.4,0 0,0 0,80 90.4,80
  pour Bottom: 15.2,40.8 15.2,49.4 35.2,49.4 35.2,39 32.2,36 21,36
ISS_VBUS
  Top 0.254: R6002.1 11.7,44.6 12.95,44.6 R6011.2 | D5101.1 8.75,45.05 11.2,42.6
  pour Top (no thermals): 13.7,25.6 10.1,22 0.2,22 0.2,26.4 7.6,26.4 10.6,29.4 10.6,43.2 12.6,43.2 12.6,42.5 13.7,41.4
N$1
  Top 1.016: R6004.1 15.22,28.5 | 15.22,28.5 R6003.1 | C6018.1 15.22,28.5
N$2  (via drill 0.3)
  Top 0.2: U6001.21 32.25,48.25
  Top 0.254: v44.7,48.1 44.02,48.1 Q6007.4 | 32.25,48.25 35.35,48.25 v35.5,48.4
  Bottom 0.254: v35.5,48.4 35.8,48.1 v44.7,48.1
N$3
  Top 0.254: C6032.1 R6023.1
N$4
  Top 0.2: U6001.20 32.25,47.85
  Top 0.254: R6015.1 39,47 38.15,47.85 32.25,47.85
N$5
  Top 0.254: R6008.1 42.7,43.9 41.15,43.9 C6027.1 R6015.2
  Top 1.016: C6028.1 42.6,46.65
  pour Top (rank 2, no thermals): 41.8,48.5 43.6,48.5 43.6,45.4 41.8,45.4
N$6  (via drill 0.3)
  Top 0.254: v15.9,41.3 18.2,39 18.2,35 22.6,30.6 70.8,30.6 72.72,32.52 R5102.1 72.72,37.17 Q5102.4 | v9,41.3 2.9,41.3 1.2,43 1.2,50.05 R5104.2
  Bottom 0.254: v15.9,41.3 v9,41.3
N$7
  Top 0.2: U6001.19 32.25,47.45
  Top 0.254: R6016.1 37.3,46.9 36.75,47.45 32.25,47.45
N$8  (via drill 0.3)
  Top 0.2: U6001.31 28.43,50.77 28.4,50.8
  Top 0.254: v19.52,51.35 20.3,51.35 Q6001.4 | 28.4,50.8 27.45,51.75 v27.45,51.85
  Bottom 0.254: v19.52,51.35 26.95,51.35 v27.45,51.85
N$9  (via drill 0.3)
  Top 0.2: U6001.29 29.23,50.87
  Top 0.254: Q6002.4 19.55,56.46 v19.52,56.43 18.29,56.43 C6019.1 | 29.23,50.87 29.23,51.3 28.72,51.81 v28.72,52.06
  Bottom 0.254: v19.52,56.43 24.1,56.43 28.47,52.06 v28.72,52.06
N$10
  Top 0.2: U6001.30 28.83,50.87
  Top 0.254: 28.83,50.87 28.83,51.04 28.1,51.77 28.1,53.13 C6015.2
N$11
  Top 0.2: U6001.23 32.2,49.05
  pour Top (rank 2, no thermals): 39.46,53.79 35.8,53.8 35.8,52.2 32.6,49 32.1,49 32.1,49.1 32.1,49.2 32.73,49.83 32.73,53.84 31.92,54.65 31.9,62.5 34.3,62.5 34.26,59.48 35.27,58.46 39.46,58.46
N$12
  Top 0.2: U6001.17 32.25,46.65
  Top 0.254: R6023.2 36.8,41.7 C6034.1 36.75,42.45 32.55,46.65 32.25,46.65
N$13
  Top 0.254: U5100.4 11.5,57.05 R5103.1
N$14
  Top 0.2: U6001.8 26.8,46.65 26.7,46.55 26.7,46.45
  Top 0.254: R6030.2 C6036.1 24.75,40.85 26.7,42.8 26.7,46.15 26.7,46.45
N$15
  Top 0.2: U6001.6 26.6,47.45
  Top 0.254: R6019.1 20.1,41.2 24.9,46 25.3,46 25.7,46.4 25.7,46.8 26.35,47.45 26.6,47.45
N$16
  Top 0.254: R6022.1 C6033.1
N$17  (via drill 0.3)
  Top 0.2: U6001.26 30.43,50.87
  Top 0.254: Q6003.4 36.19,59.38 v36.03,59.48 36.03,60.92 C6020.2 | 30.43,50.87 30.43,51.08 30.9,51.55 v30.9,51.8
  Bottom 0.254: v36.03,59.48 36.03,56.69 31.15,51.8 v30.9,51.8
N$18  (via drill 0.3)
  Top 0.2: U6001.24 32.15,49.45
  Top 0.254: Q6004.4 36.57,54.17 v36.29,53.89 | 32.22,49.83 v32.22,50.08 32.22,49.52 32.15,49.45
  Bottom 0.254: v36.29,53.89 32.48,50.08 v32.22,50.08
N$19
  Top 0.2: U6001.16 30.83,45.22
  Top 0.254: R6022.2 31.4,41.7 C6031.1 31.45,44.6 30.83,45.22
N$20
  Top 0.2: U6001.32 28.03,50.47 27.7,50.8
  pour Top (rank 2, no thermals): 27.8,50.7 26.9,51.6 26.9,62.5 24.6,62.5 24.6,55.8 24.2,55.4 20.8,55.4 20.8,51 26.5,51 26.9,50.6 27.8,50.6
N$21
  Top 0.2: U6001.10 28.43,45.23
  Top 0.254: R6034.2 28.43,40.72 28.43,45.23
N$22
  Top 0.2: U6001.9 28.03,45.23
  Top 0.254: C6037.1 26.4,41 27.7,42.3 27.7,44 28.03,44.33 28.03,45.23
N$23
  Top 0.254: Q5101.1 4.65,60 R5101.2 R5105.1
N$24
  Top 0.254: R5104.1 3.7,54.25 Q5101.3
N$25
  Top 0.2: U6001.3 26.6,48.65
  Top 0.254: R6011.1 16.5,44.1 C6046.1 17.05,44.6 21.5,44.6 25.55,48.65 26.6,48.65
N$26
  Top 0.2: U6001.2 26.6,49.05
  Top 0.254: R6012.1 16.5,45.7 C6047.1 17.15,45.1 21.3,45.1 25.25,49.05 26.6,49.05
N$27
  Top 0.2: U6001.25 30.83,50.88
  Top 0.254: C6016.2 31.85,51.9 30.83,50.88
N$28
  Top 0.2: U6001.1 26.6,49.45
  Top 0.254: Q6001.TP5 20.75,48.2 C6025.1 20.75,47.3 22.7,47.3 24.85,49.45 26.6,49.45 | R6002.2 11.7,45.2 12.95,45.2 R6012.2
  pour Top (no thermals): 13.7,47.9 22.5,47.9 22.5,50.6 12.5,50.6 10.7,48.8 10.7,46.5 12.7,46.5 12.7,46.9
N$30
  Top 0.254: Q5103.2 12.75,60.65 13.95,61.85 15,61.85 R5107.1 15.55,61.85 R5100.2 C5100.1
N$32
  Top 0.2: U5001.28 57.8,45.75
  Top 0.254: R5010.1 57.4,44.75 57.8,45.15 57.8,45.75
N$34
  Top 1.016: C5001.2 C5002.1
N$35
  Top 0.254: R5009.2 55.17,39.08 Q5003.TP1
  pour Top (no thermals): 63.5,39.8 54.7,39.8 54.7,35 63.5,35
N$36
  Top 0.254: Q5103.3 12.1,63.2 11.3,64 R5106.1
N$37
  Top 0.254: R5007.2 62.6,41.95 R5002.1 62.65,40.98 Q5002.4
N$38
  Top 0.2: U5001.31 59,45.75
  Top 0.254: 59,45.75 59,45.25 59.65,44.6 60.5,44.6 60.9,44.2 R5007.1
N$39
  Top 1.016: Q5001.3 65.8,33.1 66.6,33.9 R5001.2
N$40  (via drill 0.3)
  Top 0.254: R5008.2 v60.6,40.55 | Q5001.1 64.75,35.15 63.8,34.2 v61.7,34.2 61.05,34.2 R5005.1
  Bottom 0.254: v60.6,40.55 60.6,35.3 v61.7,34.2
N$41
  Top 0.2: U5001.26 57,45.75
  Top 0.254: 57,45.75 57,45.65 55.17,43.82 R5009.1
N$42
  Top 0.254: U5100.5 13,55.35 C5101.1 7.9,55.35 C5102.1 6.7,54.15 D5100.3
N$43  (via drill 0.3)
  Top 0.203: 53.67,37.1 Q5003.4 53.6,37.12
  Top 0.254: R5003.1 53.6,33.25 | 53.6,37.12 v53.6,34.3 53.6,33.25 | Q5004.3 53.6,33.25 | v56.2,40.7 57.4,41.9 R5010.2
  Bottom 0.254: v53.6,34.3 53.6,38.7 55.6,40.7 v56.2,40.7
N$44
  Top 0.2: U5001.30 58.6,45.75
  Top 0.254: R5008.1 58.6,44.25 58.6,45.75
N$45
  Top 0.254: R5004.2 55.5,33.4 54.55,34.35 Q5004.1
N$46
  Top 0.2: U5001.27 57.4,45.75
  Top 0.254: R5012.1 53.1,42.8 56,42.8 56.3,43.1 56.3,44.3 57.4,45.4 57.4,45.75
N$47
  Top 0.2: U5001.2 60.75,47.5
  Top 0.254: R5020.2 75.1,44.35 C5014.1 69.25,44.35 66.3,47.3 66.1,47.5 60.75,47.5
N$48  (via drill 0.3)
  Top 0.2: U5001.3 60.75,47.9
  Top 0.254: v77.7,57 77.7,49.5 74.25,46.05 C5014.2 C5015.1 68.55,46.05 66.7,47.9 60.75,47.9 | v77.7,64 79.35,65.65 R5021.2
  Bottom 0.254: v77.7,64 v77.7,57
N$49  (via drill 0.3)
  Top 0.2: U5001.4 60.75,48.3
  Top 0.254: v74.2,47.75 C5016.1 C5015.2 68.25,47.75 67.7,48.3 60.75,48.3 | v70.2,26 60.35,16.15 R5022.2
  Bottom 0.254: v74.2,47.75 74.2,42 71.2,39 71.2,27 v70.2,26
N$50  (via drill 0.3)
  Top 0.2: U5001.5 60.75,48.7
  Top 0.254: v72.2,64 53.2,64 42.7,74.5 R5023.2 | v76.2,57 76.2,52 73.65,49.45 C5016.2 C5017.1 68.45,49.45 67.7,48.7 60.75,48.7
  Bottom 0.254: v72.2,64 76.2,60 v76.2,57
N$51
  Top 0.2: U5001.1 60.75,47.1
  Top 0.254: C5013.1 61.65,47.1 60.75,47.1
N$52  (via drill 0.3)
  Top 0.2: U5001.24 55.25,47.1 | U5001.32 59.4,45.75
  Top 0.203: 60.3,45.1 60.7,45.1 v60.7,45.7
  Top 0.254: D5001.3 66.61,42.59 66.1,43.1 63.2,43.1 61.2,45.1 60.3,45.1 59.85,45.1 59.4,45.55 59.4,45.75 | RT5001.1 59.75,40.05 v59.5,40.3 | v54.5,44.7 54.5,45.35 C5012.1 54.05,47.1 55.25,47.1
  Bottom 0.254: v60.7,45.7 60.7,42.9 59.5,41.7 v59.5,40.3 55.1,44.7 v54.5,44.7
N$53  (via drill 0.3)
  Top 0.2: U5001.23 55.25,47.5
  Top 0.254: RT5001.2 58.45,40.05 v58.7,40.3 | v53.6,44.7 52.4,45.9 52.4,47.15 C5012.2 54.05,47.5 55.25,47.5
  Bottom 0.254: v53.6,44.7 58,40.3 v58.7,40.3
N$54  (via drill 0.3)
  Top 0.2: U5001.6 60.75,49.1
  Top 0.254: 19.65,7.75 R5031.2 20.95,6.5 27.7,6.5 44.2,23 51.9,23 53.3,24.4 v53.3,24.7 | v67,49.7 66.85,49.55 C5018.2 65.15,49.1 60.75,49.1
  Bottom 0.254: v53.3,24.7 53.6,24.7 67.2,38.3 67.2,49.5 v67,49.7
N$55  (via drill 0.3)
  Top 0.2: U5001.8 60.8,49.9
  Top 0.254: 60.8,49.9 61.3,50.4 64.75,50.4 C5018.1 66.95,51.25 v67.6,50.6 | R5030.2 19.65,6.05 27.95,6.05 44.4,22.5 52.1,22.5 54.3,24.7 v54.5,24.7
  Bottom 0.254: v54.5,24.7 54.5,24.9 67.6,38 v67.6,50.6
N$56
  Top 0.2: U6001.18 32.25,47.05
  Top 0.254: R6020.1 28.8,35.35 R6028.2 32.25,35.35 34.2,37.3 37.5,37.3 38.2,38 38.2,42 33.15,47.05 32.25,47.05
N$62  (via drill 0.3)
  Top 0.2: U5001.10 59,51.25
  Top 0.254: v59.4,54.1 59.4,52.9 59,52.5 59,51.25
  Bottom 0.254: RT5002.P$2 25.13,31.2 33.8,31.2 56.7,54.1 v59.4,54.1
N$63  (via drill 0.3)
  Top 0.2: U5001.11 58.6,51.25
  Top 0.254: 58.6,51.25 58.6,53 v58.8,53.2
  Bottom 0.254: RT5003.P$2 28.43,30.5 34.2,30.5 56.9,53.2 v58.8,53.2
N$64  (via drill 0.3)
  Top 0.2: U5001.12 58.2,51.25
  Top 0.254: v72.2,53 69.7,55.5 59.4,55.5 58.2,54.3 58.2,51.25
  Bottom 0.254: v72.2,53 72.2,42.2 69.6,39.6 69.6,35.67 RT5004.P$2
N$65  (via drill 0.3)
  Top 0.2: U5001.13 57.8,51.25
  Top 0.254: v73,53.1 70.1,56 59.2,56 57.8,54.6 57.8,51.25
  Bottom 0.254: v73,53.1 73,41.9 70.4,39.3 70.4,32.47 RT5005.P$2
N$77
  Top 0.254: R5105.2 11.45,60 Q5103.1 11.45,58.4 R5103.2
N$78
  Top 0.254: 14.5,56.1 U5100.2 | D5101.3 5.75,48.3 D5100.1 5.75,51.85 6.1,52.2 12.2,52.2 14.5,54.5 14.5,56 14.5,56.1 | R5107.2 14.5,59.15 14.5,56.1
OUT  (via drill 0.3)
  Top 0.254: D5100.2 7.65,45.15 9.6,43.2 v9.8,43.2 | v14.1,42.1 17.3,38.9 17.3,34.9 21.2,31 21.2,29 22.2,28 70.2,28 v73.2,31 | U5110.3 79.3,32.5 v79.3,34.1 79.3,35.5 C5111.1
  Bottom 0.254: v9.8,43.2 9.8,43 10.7,42.1 v14.1,42.1 | v73.2,31 76.3,34.1 v79.3,34.1
REGN  (via drill 0.3)
  Top 0.2: U6001.28 29.63,50.87
  Top 0.254: C6030.1 29.6,52.7 v29.6,51.8 29.63,51.77 29.63,50.87 | R6018.2 26,43.89 v26,45
  Bottom 0.254: v29.6,51.8 29.6,50.6 29,50 27.1,50 26,48.9 v26,45
SMBC  (via drill 0.3)
  Top 0.2: U6001.13 29.63,45.23 | U5001.19 55.25,49.1
  Top 0.254: v30,36.9 29.63,37.27 29.63,45.23 | v47.4,48.7 47.8,49.1 55.25,49.1 | v9.7,39.1 7.7,39.1 6.6,38 6.6,30.1 P6000.2
  Bottom 0.254: v9.7,39.1 17.1,39.1 20.4,35.8 28.9,35.8 v30,36.9 35.6,36.9 v47.4,48.7
SMBD  (via drill 0.3)
  Top 0.2: U6001.12 29.23,45.23 | U5001.18 55.25,49.5
  Top 0.254: v47.4,49.6 47.5,49.5 55.25,49.5 | v9,39.8 7.3,39.8 5.9,38.4 5.9,31.6 P6000.3 | 29.23,45.23 29.23,37.23 v28.9,36.9
  Bottom 0.254: v9,39.8 17.4,39.8 20.8,36.4 28.4,36.4 v28.9,36.9 29.7,37.7 35.5,37.7 v47.4,49.6
VBAT
  Top 0.254: R5012.2 53.1,39.08 Q5003.1 | R6008.2 42.7,43.3 41.15,43.3 C6027.2 40.05,43.3 37.9,43.3 37.3,43.9 R6016.2
  pour Top (no thermals): 41.8,33.8 41.8,42.1 43.6,42.1 45.5,40.2 54.1,40.2 54.1,37 53.1,37 53.1,34.8 52.2,34.8 52.2,37 51.7,37 49.7,35 49.7,32 56.1,32 56.1,31.1 44.5,31.1
VDDA
  Top 0.2: U6001.7 26.6,47.05
  Top 0.254: 26.6,47.05 26.2,46.65 26.2,46.1 24.4,44.3 C6029.1 24.4,42.29 R6018.1 23.59,41.99 20.1,38.5 | R6020.2 22.1,35.4 20.1,37.4 20.1,38 20.1,38.5 | 20.1,38.5 R6019.2
VSS  (via drill 0.3)
  Top 0.2: U5001.7 60.75,49.5 | U5001.9 59.4,51.35 v59.6,51.55 | U5001.14 57.4,51.25 | U5001.25 56.6,45.9 56.45,45.75 56.25,45.75 | U5001.29 58.2,45.75
  Top 0.254: v58,44.6 58.2,44.8 58.2,45.75 | 56.25,45.75 v55.95,45.75 | R5019.1 15.6,6.6 17.35,6.6 R5030.1 | v69.2,51.15 C5017.2 | C5013.2 v65.55,46.4 | 57.4,51.25 57.4,51.35 v57.2,51.55 | 60.75,49.5 61.2,49.5 v61.4,49.7
  Top 1.93: RT5005.P$1 RT5004.P$1 RT5003.P$1 RT5002.P$1 11.2,14.73 11.2,6.84 XBT5001.1-
  Bottom 1.93: RT5003.P$1 32.93,26.73 54.7,48.5 U5001.TP1
  pour Bottom: 55.4,46.1 55.4,49.9 57.2,51.7 68.9,51.7 69.4,51.2 69.4,48.6 65.2,44.4 57.1,44.4
  pour Top (no thermals): 12.4,0 12.4,3 14.7,5.3 16.5,5.3 18.9,2.9 18.9,0
VSYS_UPS
  Top 0.254: F6000.P$3 84.01,29.56 U5110.1 84.01,35.5 C5110.1
  pour Top: 90.2,31 85.2,31 85.2,22 90.2,22
VSYS_UPS_PREFUSE
  Top 0.2: U6001.22 32.2,48.65
  pour Top (no thermals): 90.2,58 85.2,63 52.63,63 51,61.4 51,60.37 46.13,55.5 44.6,55.5 42.3,53.2 37.2,53.2 32.7,48.7 32.1,48.7 32.1,48.6 46.9,48.6 48.3,50 48.3,53.02 53.28,58 82.2,58 85.2,55 85.2,33 90.2,33

### Text on the board
tPlace: VSYS_UPS | ISS_VBUS | GND_IN | GND_IN | power supply unit | v1.0 David Merges